# Altium project PCB_Project1.PrjPCB
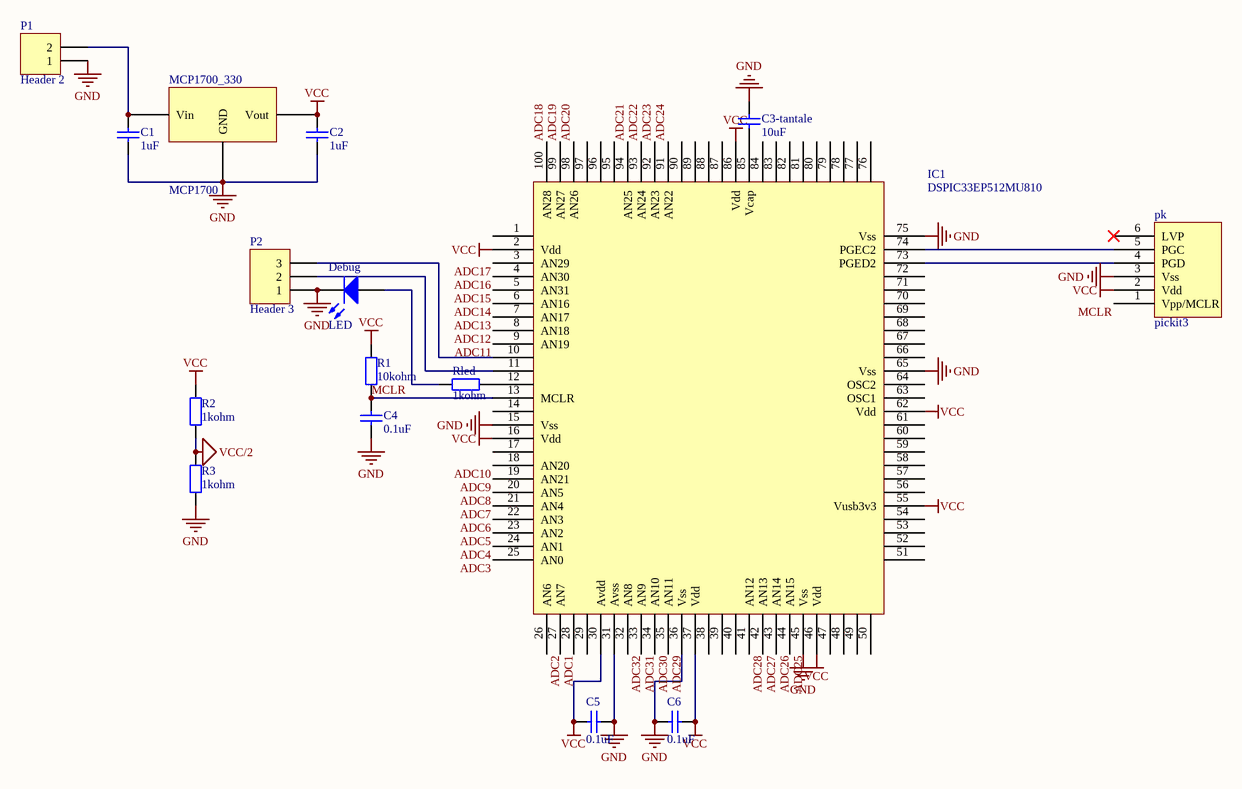
[diagram p0: Sheet1.SchDoc]
7 sheets, 224 parts. Net scope: global (net labels, ports and power ports of the same name join across sheets).
Board file: PCB1.PcbDoc
Sheets:
  Sheet1.SchDoc
  Sheet2.SchDoc
  Sheet3.SchDoc
  Sheet4.SchDoc
  Sheet5.SchDoc
  Sheet6.SchDoc
  Sheet7.SchDoc

## Sheet Sheet1.SchDoc
size A4

### Parts
C1  1uF  [cms805 - mini]
C2  1uF  [cms805 - mini]
C3-tantale  10uF  [cms805]
C4  0.1uF  [cms805 - mini]
C5  0.1uF  [cms805 - mini]
C6  0.1uF  [cms805 - mini]
Debug  LED  [cms1206]
IC1  DSPIC33EP512MU810  [TQFP100PF]
MCP1700_330  MCP1700  [SOT89]
P1  Header 2  [HDR1X2]
P2  Header 3  [HDR1X3]
pk  pickit3  [pickit3]
R1  10kohm  [cms805 - mini]
R2  1kohm  [cms805 - mini]
R3  1kohm  [cms805 - mini]
Rled  1kohm  [cms805 - mini]

### Nets
GND: C1.1 C2.1 C3-tantale.2 C4.1 C5.1 C6.2 Debug.2(K) IC1.15(Vss) IC1.31(Avss) IC1.36(Vss) IC1.45(Vss) IC1.65(Vss) IC1.75(Vss) MCP1700_330.1(GND) P1.1 P2.1 pk.3(Vss) R3.1
VCC: C2.2 C5.2 C6.1 IC1.2(Vdd) IC1.16(Vdd) IC1.30(Avdd) IC1.37(Vdd) IC1.46(Vdd) IC1.55(Vusb3v3) IC1.62(Vdd) IC1.86(Vdd) MCP1700_330.3(Vout) pk.2(Vdd) R1.2 R2.2
VCC/2: R2.1 R3.2
ADC1: IC1.27(AN7)
ADC2: IC1.26(AN6)
ADC3: IC1.25(AN0)
ADC4: IC1.24(AN1)
ADC5: IC1.23(AN2)
ADC6: IC1.22(AN3)
ADC7: IC1.21(AN4)
ADC8: IC1.20(AN5)
ADC9: IC1.19(AN21)
ADC10: IC1.18(AN20)
ADC11: IC1.9(AN19)
ADC12: IC1.8(AN18)
ADC13: IC1.7(AN17)
ADC14: IC1.6(AN16)
ADC15: IC1.5(AN31)
ADC16: IC1.4(AN30)
ADC17: IC1.3(AN29)
ADC18: IC1.100(AN28)
ADC19: IC1.99(AN27)
ADC20: IC1.98(AN26)
ADC21: IC1.94(AN25)
ADC22: IC1.93(AN24)
ADC23: IC1.92(AN23)
ADC24: IC1.91(AN22)
ADC25: IC1.44(AN15)
ADC26: IC1.43(AN14)
ADC27: IC1.42(AN13)
ADC28: IC1.41(AN12)
ADC29: IC1.35(AN11)
ADC30: IC1.34(AN10)
ADC31: IC1.33(AN9)
ADC32: IC1.32(AN8)
MCLR: C4.2 IC1.13(MCLR) pk.1(Vpp/MCLR) R1.1
NetC1_2: C1.2 MCP1700_330.2(Vin) P1.2
NetC3-tantale_1: C3-tantale.1 IC1.85(Vcap)
NetDebug_1: Debug.1(A) Rled.2
NetIC1_10: IC1.10 P2.3
NetIC1_11: IC1.11 P2.2
NetIC1_12: IC1.12 Rled.1
NetIC1_73: IC1.73(PGED2) pk.4(PGD)
NetIC1_74: IC1.74(PGEC2) pk.5(PGC)

Not connected (* = marked no-connect by the designer): IC1 1 14 17 28 29 38 39 40 47 48 49 50 51 52 53 54 56 57 58 59 60 61 63(OSC1) 64(OSC2) 66 67 68 69 70 71 72 76 77 78 79 80 81 82 83 84 87 88 89 90 95 96 97; pk 6(LVP)*

### Library data of the parts
C1 C2 C3-tantale C4-C6 = Capa
P1 = Header 2: Header, 2-Pin; LatestRevisionDate: 17-Jul-2002; LatestRevisionNote: Re-released for DXP Platform.; Publisher: Altium Limited
P2 = Header 3: Header, 3-Pin; LatestRevisionDate: 17-Jul-2002; LatestRevisionNote: Re-released for DXP Platform.; Publisher: Altium Limited
R1-R3 Rled = Resistance

## Sheet Sheet2.SchDoc
size A4
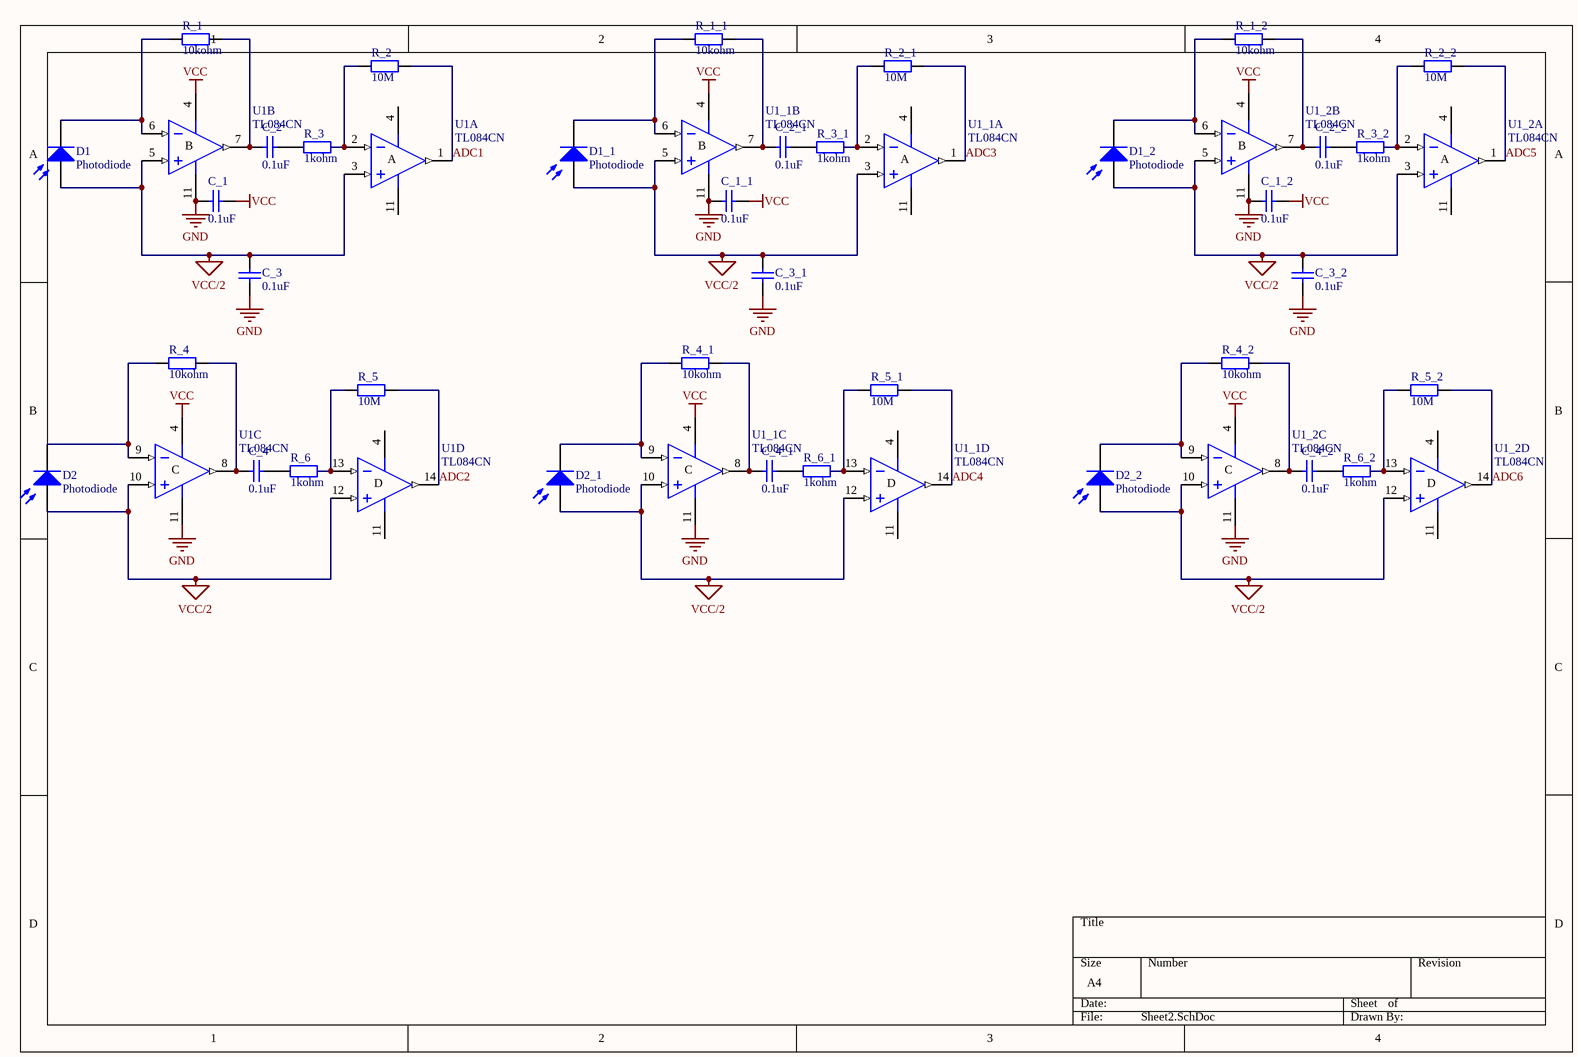
[diagram p1: Sheet2.SchDoc]

### Parts
C_1  0.1uF  [cms805 - mini]
C_1_1  0.1uF  [cms805 - mini]
C_1_2  0.1uF  [cms805 - mini]
C_2  0.1uF  [cms805 - mini]
C_2_1  0.1uF  [cms805 - mini]
C_2_2  0.1uF  [cms805 - mini]
C_3  0.1uF  [cms805 - mini]
C_3_1  0.1uF  [cms805 - mini]
C_3_2  0.1uF  [cms805 - mini]
C_4  0.1uF  [cms805 - mini]
C_4_1  0.1uF  [cms805 - mini]
C_4_2  0.1uF  [cms805 - mini]
D1  Photodiode  [TEMD1000]
D1_1  Photodiode  [TEMD1000]
D1_2  Photodiode  [TEMD1000]
D2  Photodiode  [TEMD1000]
D2_1  Photodiode  [TEMD1000]
D2_2  Photodiode  [TEMD1000]
R_1  10kohm  [cms805 - mini]
R_1_1  10kohm  [cms805 - mini]
R_1_2  10kohm  [cms805 - mini]
R_2  10M  [cms805 - mini]
R_2_1  10M  [cms805 - mini]
R_2_2  10M  [cms805 - mini]
R_3  1kohm  [cms805 - mini]
R_3_1  1kohm  [cms805 - mini]
R_3_2  1kohm  [cms805 - mini]
R_4  10kohm  [cms805 - mini]
R_4_1  10kohm  [cms805 - mini]
R_4_2  10kohm  [cms805 - mini]
R_5  10M  [cms805 - mini]
R_5_1  10M  [cms805 - mini]
R_5_2  10M  [cms805 - mini]
R_6  1kohm  [cms805 - mini]
R_6_1  1kohm  [cms805 - mini]
R_6_2  1kohm  [cms805 - mini]
U1  TL084CN  [TSSOP14]  (parts A,B,C,D of 4)
U1_1  TL084CN  [TSSOP14]  (parts A,B,C,D of 4)
U1_2  TL084CN  [TSSOP14]  (parts A,B,C,D of 4)

### Nets
GND: C_1.1 C_1_1.1 C_1_2.1 C_3.1 C_3_1.1 C_3_2.1 U1.11(V-) U1_1.11(V-) U1_2.11(V-)
VCC: C_1.2 C_1_1.2 C_1_2.2 U1.4(V+) U1_1.4(V+) U1_2.4(V+)
VCC/2: C_3.2 C_3_1.2 C_3_2.2 D1.1(A) D1_1.1(A) D1_2.1(A) D2.1(A) D2_1.1(A) D2_2.1(A) U1.3(IN+) U1.5(IN+) U1.10(IN+) U1.12(IN+) U1_1.3(IN+) U1_1.5(IN+) U1_1.10(IN+) U1_1.12(IN+) U1_2.3(IN+) U1_2.5(IN+) U1_2.10(IN+) U1_2.12(IN+)
ADC1: R_2.2 U1.1(OUT)
ADC2: R_5.2 U1.14(OUT)
ADC3: R_2_1.2 U1_1.1(OUT)
ADC4: R_5_1.2 U1_1.14(OUT)
ADC5: R_2_2.2 U1_2.1(OUT)
ADC6: R_5_2.2 U1_2.14(OUT)
NetC_2_1: C_2.1 R_3.1
NetC_2_1_1: C_2_1.1 R_3_1.1
NetC_2_1_2: C_2_1.2 R_1_1.2 U1_1.7(OUT)
NetC_2_2: C_2.2 R_1.2 U1.7(OUT)
NetC_2_2_1: C_2_2.1 R_3_2.1
NetC_2_2_2: C_2_2.2 R_1_2.2 U1_2.7(OUT)
NetC_4_1: C_4.1 R_6.1
NetC_4_1_1: C_4_1.1 R_6_1.1
NetC_4_1_2: C_4_1.2 R_4_1.2 U1_1.8(OUT)
NetC_4_2: C_4.2 R_4.2 U1.8(OUT)
NetC_4_2_1: C_4_2.1 R_6_2.1
NetC_4_2_2: C_4_2.2 R_4_2.2 U1_2.8(OUT)
NetD1_1_2: D1_1.2(K) R_1_1.1 U1_1.6(IN-)
NetD1_2: D1.2(K) R_1.1 U1.6(IN-)
NetD1_2_2: D1_2.2(K) R_1_2.1 U1_2.6(IN-)
NetD2_1_2: D2_1.2(K) R_4_1.1 U1_1.9(IN-)
NetD2_2: D2.2(K) R_4.1 U1.9(IN-)
NetD2_2_2: D2_2.2(K) R_4_2.1 U1_2.9(IN-)
NetR_2_1: R_2.1 R_3.2 U1.2(IN-)
NetR_2_1_1: R_2_1.1 R_3_1.2 U1_1.2(IN-)
NetR_2_2_1: R_2_2.1 R_3_2.2 U1_2.2(IN-)
NetR_5_1: R_5.1 R_6.2 U1.13(IN-)
NetR_5_1_1: R_5_1.1 R_6_1.2 U1_1.13(IN-)
NetR_5_2_1: R_5_2.1 R_6_2.2 U1_2.13(IN-)

### Notes on the sheet
- (in symbol TL084CN, part A) A
- (in symbol TL084CN, part B) B
- (in symbol TL084CN, part C) C
- (in symbol TL084CN, part D) D

### Library data of the parts
C_1 C_1_1 C_1_2 C_2 C_2_1 C_2_2 C_3 C_3_1 C_3_2 C_4 C_4_1 C_4_2 = Capa
R_1 R_1_1 R_1_2 R_2 R_2_1 R_2_2 R_3 R_3_1 R_3_2 R_4 R_4_1 R_4_2 R_5 R_5_1 R_5_2 R_6 R_6_1 R_6_2 = Resistance
U1 U1_1 U1_2 = TL084CN: General-Purpose J-FET Quad Operational Amplifier; Published: 24-Aug-2001; LatestRevisionDate: 06-Jun-2005; LatestRevisionNote: Stylized 3D Model Added.; DatasheetVersion: Jan-1999; PackageVersion: Jan-1997; PackageReference: DIP14; Publisher: Altium Limited; PackageDescription: DIP; 14 Leads; Row Spacing 7.62 mm; Pitch 2.54 mm; ComponentLink1Description: Manufacturer Link; ComponentLink1URL: http://www.st.com/; ComponentLink2Description: Datasheet; ComponentLink2URL: http://www.st.com/stonline/products/literature/ds/2301/tl084.pdf
D1 D1_1 D1_2 D2 D2_1 D2_2 = Photodiode: Published: 24-Mar-1999; LatestRevisionDate: 17-Jul-2002; LatestRevisionNote: Re-released for DXP Platform.; PackageReference: PIN2; Publisher: Altium Limited

## Sheet Sheet3.SchDoc
size A4
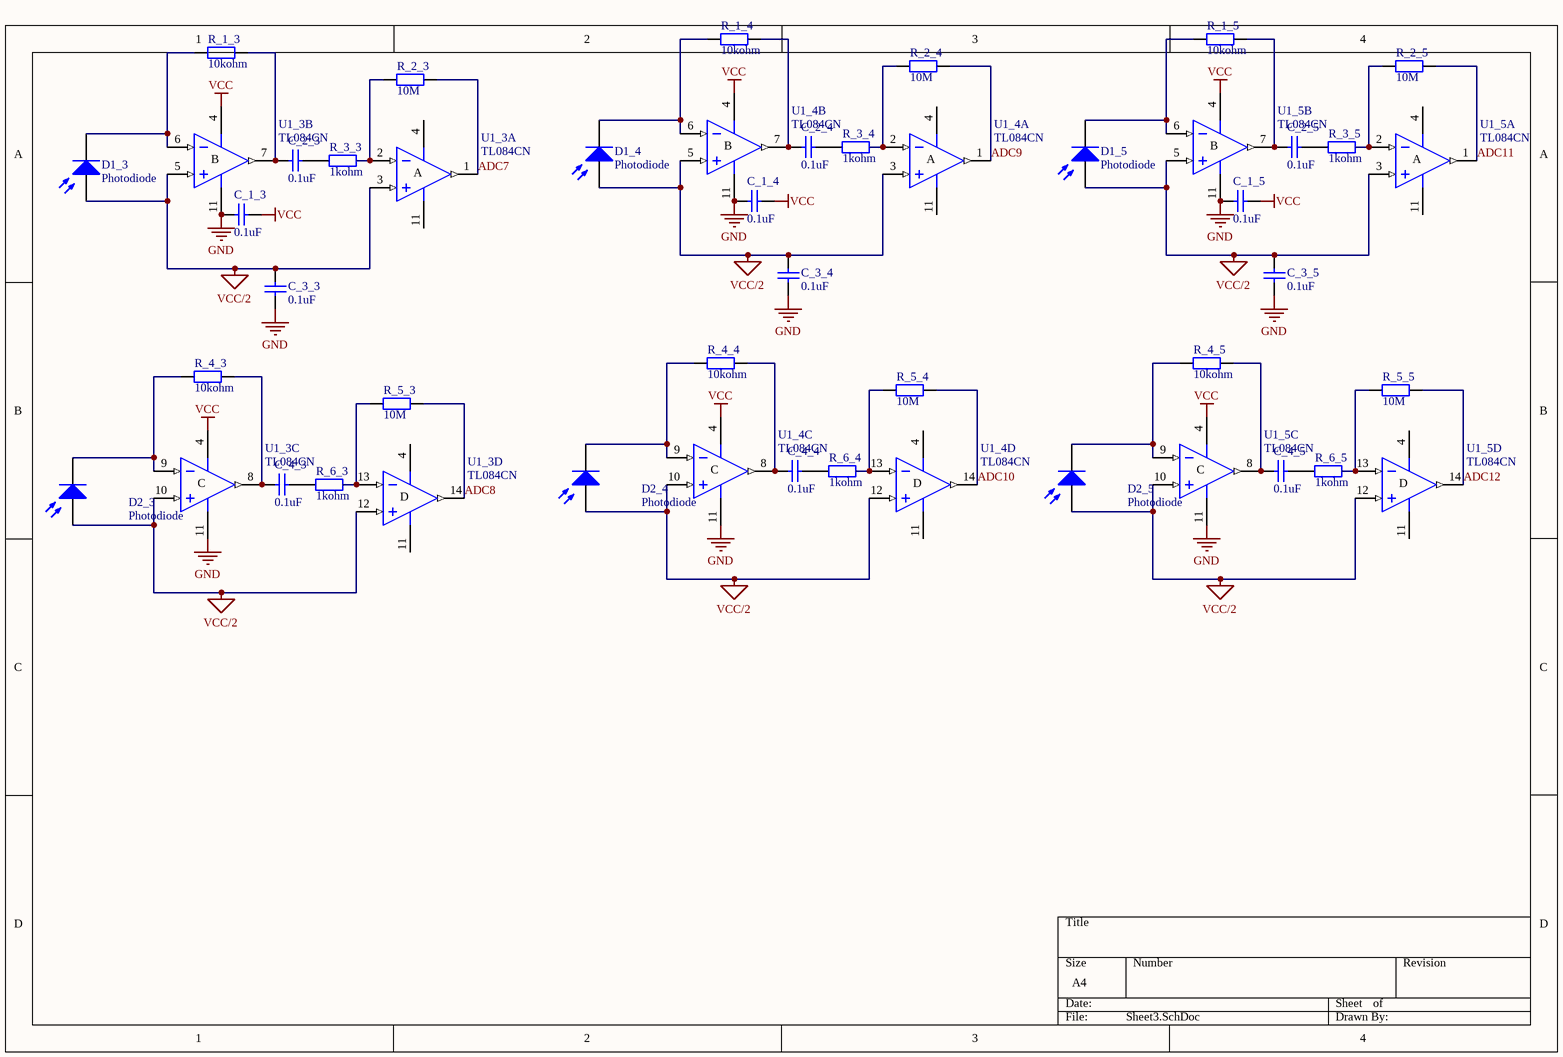
[diagram p2: Sheet3.SchDoc]

### Parts
C_1_3  0.1uF  [cms805 - mini]
C_1_4  0.1uF  [cms805 - mini]
C_1_5  0.1uF  [cms805 - mini]
C_2_3  0.1uF  [cms805 - mini]
C_2_4  0.1uF  [cms805 - mini]
C_2_5  0.1uF  [cms805 - mini]
C_3_3  0.1uF  [cms805 - mini]
C_3_4  0.1uF  [cms805 - mini]
C_3_5  0.1uF  [cms805 - mini]
C_4_3  0.1uF  [cms805 - mini]
C_4_4  0.1uF  [cms805 - mini]
C_4_5  0.1uF  [cms805 - mini]
D1_3  Photodiode  [TEMD1000]
D1_4  Photodiode  [TEMD1000]
D1_5  Photodiode  [TEMD1000]
D2_3  Photodiode  [TEMD1000]
D2_4  Photodiode  [TEMD1000]
D2_5  Photodiode  [TEMD1000]
R_1_3  10kohm  [cms805 - mini]
R_1_4  10kohm  [cms805 - mini]
R_1_5  10kohm  [cms805 - mini]
R_2_3  10M  [cms805 - mini]
R_2_4  10M  [cms805 - mini]
R_2_5  10M  [cms805 - mini]
R_3_3  1kohm  [cms805 - mini]
R_3_4  1kohm  [cms805 - mini]
R_3_5  1kohm  [cms805 - mini]
R_4_3  10kohm  [cms805 - mini]
R_4_4  10kohm  [cms805 - mini]
R_4_5  10kohm  [cms805 - mini]
R_5_3  10M  [cms805 - mini]
R_5_4  10M  [cms805 - mini]
R_5_5  10M  [cms805 - mini]
R_6_3  1kohm  [cms805 - mini]
R_6_4  1kohm  [cms805 - mini]
R_6_5  1kohm  [cms805 - mini]
U1_3  TL084CN  [TSSOP14]  (parts A,B,C,D of 4)
U1_4  TL084CN  [TSSOP14]  (parts A,B,C,D of 4)
U1_5  TL084CN  [TSSOP14]  (parts A,B,C,D of 4)

### Nets
GND: C_1_3.1 C_1_4.1 C_1_5.1 C_3_3.1 C_3_4.1 C_3_5.1 U1_3.11(V-) U1_4.11(V-) U1_5.11(V-)
VCC: C_1_3.2 C_1_4.2 C_1_5.2 U1_3.4(V+) U1_4.4(V+) U1_5.4(V+)
VCC/2: C_3_3.2 C_3_4.2 C_3_5.2 D1_3.1(A) D1_4.1(A) D1_5.1(A) D2_3.1(A) D2_4.1(A) D2_5.1(A) U1_3.3(IN+) U1_3.5(IN+) U1_3.10(IN+) U1_3.12(IN+) U1_4.3(IN+) U1_4.5(IN+) U1_4.10(IN+) U1_4.12(IN+) U1_5.3(IN+) U1_5.5(IN+) U1_5.10(IN+) U1_5.12(IN+)
ADC7: R_2_3.2 U1_3.1(OUT)
ADC8: R_5_3.2 U1_3.14(OUT)
ADC9: R_2_4.2 U1_4.1(OUT)
ADC10: R_5_4.2 U1_4.14(OUT)
ADC11: R_2_5.2 U1_5.1(OUT)
ADC12: R_5_5.2 U1_5.14(OUT)
NetC_2_3_1: C_2_3.1 R_3_3.1
NetC_2_3_2: C_2_3.2 R_1_3.2 U1_3.7(OUT)
NetC_2_4_1: C_2_4.1 R_3_4.1
NetC_2_4_2: C_2_4.2 R_1_4.2 U1_4.7(OUT)
NetC_2_5_1: C_2_5.1 R_3_5.1
NetC_2_5_2: C_2_5.2 R_1_5.2 U1_5.7(OUT)
NetC_4_3_1: C_4_3.1 R_6_3.1
NetC_4_3_2: C_4_3.2 R_4_3.2 U1_3.8(OUT)
NetC_4_4_1: C_4_4.1 R_6_4.1
NetC_4_4_2: C_4_4.2 R_4_4.2 U1_4.8(OUT)
NetC_4_5_1: C_4_5.1 R_6_5.1
NetC_4_5_2: C_4_5.2 R_4_5.2 U1_5.8(OUT)
NetD1_3_2: D1_3.2(K) R_1_3.1 U1_3.6(IN-)
NetD1_4_2: D1_4.2(K) R_1_4.1 U1_4.6(IN-)
NetD1_5_2: D1_5.2(K) R_1_5.1 U1_5.6(IN-)
NetD2_3_2: D2_3.2(K) R_4_3.1 U1_3.9(IN-)
NetD2_4_2: D2_4.2(K) R_4_4.1 U1_4.9(IN-)
NetD2_5_2: D2_5.2(K) R_4_5.1 U1_5.9(IN-)
NetR_2_3_1: R_2_3.1 R_3_3.2 U1_3.2(IN-)
NetR_2_4_1: R_2_4.1 R_3_4.2 U1_4.2(IN-)
NetR_2_5_1: R_2_5.1 R_3_5.2 U1_5.2(IN-)
NetR_5_3_1: R_5_3.1 R_6_3.2 U1_3.13(IN-)
NetR_5_4_1: R_5_4.1 R_6_4.2 U1_4.13(IN-)
NetR_5_5_1: R_5_5.1 R_6_5.2 U1_5.13(IN-)

### Notes on the sheet
- (in symbol TL084CN, part A) A
- (in symbol TL084CN, part B) B
- (in symbol TL084CN, part C) C
- (in symbol TL084CN, part D) D

### Library data of the parts
C_1_3-C_1_5 C_2_3-C_2_5 C_3_3-C_3_5 C_4_3-C_4_5 = Capa
R_1_3-R_1_5 R_2_3-R_2_5 R_3_3-R_3_5 R_4_3-R_4_5 R_5_3-R_5_5 R_6_3-R_6_5 = Resistance
U1_3-U1_5 = TL084CN: as U1 on sheet Sheet2; Published: 24-Aug-2001; LatestRevisionDate: 06-Jun-2005; LatestRevisionNote: Stylized 3D Model Added.; DatasheetVersion: Jan-1999; PackageVersion: Jan-1997; PackageReference: DIP14; Publisher: Altium Limited; PackageDescription: DIP; 14 Leads; Row Spacing 7.62 mm; Pitch 2.54 mm; ComponentLink1Description: Manufacturer Link; ComponentLink1URL: http://www.st.com/; ComponentLink2Description: Datasheet; ComponentLink2URL: http://www.st.com/stonline/products/literature/ds/2301/tl084.pdf
D1_3-D1_5 D2_3-D2_5 = Photodiode: Published: 24-Mar-1999; LatestRevisionDate: 17-Jul-2002; LatestRevisionNote: Re-released for DXP Platform.; PackageReference: PIN2; Publisher: Altium Limited

## Sheet Sheet4.SchDoc
size A4
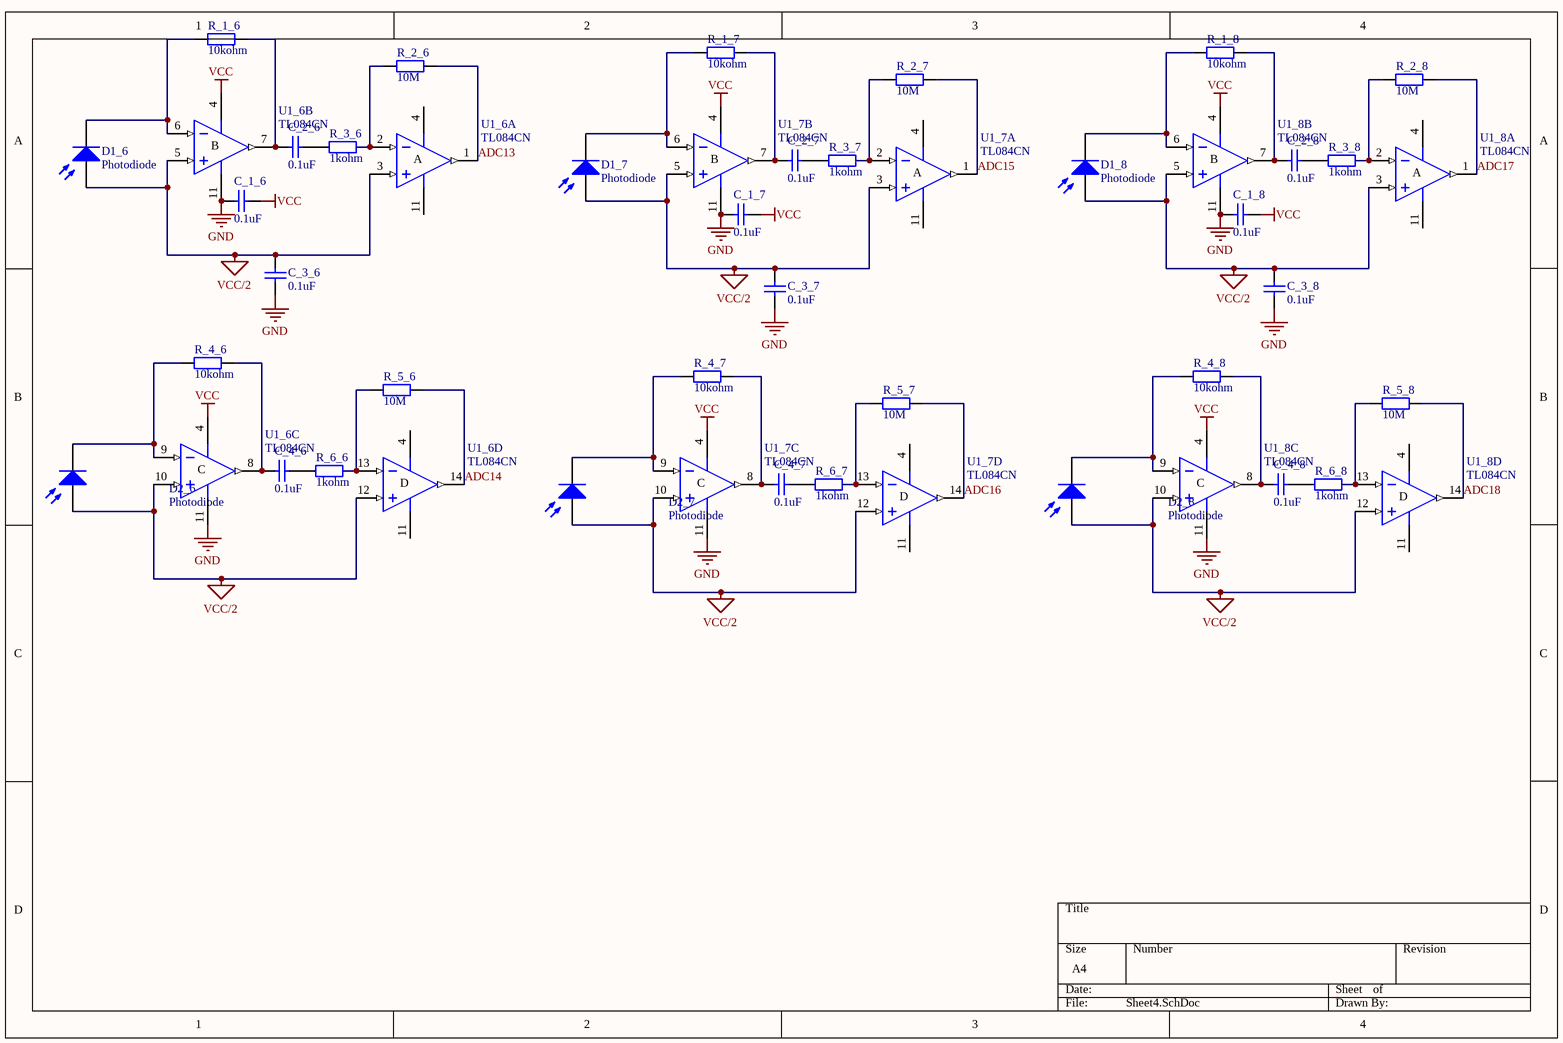
[diagram p3: Sheet4.SchDoc]

### Parts
C_1_6  0.1uF  [cms805 - mini]
C_1_7  0.1uF  [cms805 - mini]
C_1_8  0.1uF  [cms805 - mini]
C_2_6  0.1uF  [cms805 - mini]
C_2_7  0.1uF  [cms805 - mini]
C_2_8  0.1uF  [cms805 - mini]
C_3_6  0.1uF  [cms805 - mini]
C_3_7  0.1uF  [cms805 - mini]
C_3_8  0.1uF  [cms805 - mini]
C_4_6  0.1uF  [cms805 - mini]
C_4_7  0.1uF  [cms805 - mini]
C_4_8  0.1uF  [cms805 - mini]
D1_6  Photodiode  [TEMD1000]
D1_7  Photodiode  [TEMD1000]
D1_8  Photodiode  [TEMD1000]
D2_6  Photodiode  [TEMD1000]
D2_7  Photodiode  [TEMD1000]
D2_8  Photodiode  [TEMD1000]
R_1_6  10kohm  [cms805 - mini]
R_1_7  10kohm  [cms805 - mini]
R_1_8  10kohm  [cms805 - mini]
R_2_6  10M  [cms805 - mini]
R_2_7  10M  [cms805 - mini]
R_2_8  10M  [cms805 - mini]
R_3_6  1kohm  [cms805 - mini]
R_3_7  1kohm  [cms805 - mini]
R_3_8  1kohm  [cms805 - mini]
R_4_6  10kohm  [cms805 - mini]
R_4_7  10kohm  [cms805 - mini]
R_4_8  10kohm  [cms805 - mini]
R_5_6  10M  [cms805 - mini]
R_5_7  10M  [cms805 - mini]
R_5_8  10M  [cms805 - mini]
R_6_6  1kohm  [cms805 - mini]
R_6_7  1kohm  [cms805 - mini]
R_6_8  1kohm  [cms805 - mini]
U1_6  TL084CN  [TSSOP14]  (parts A,B,C,D of 4)
U1_7  TL084CN  [TSSOP14]  (parts A,B,C,D of 4)
U1_8  TL084CN  [TSSOP14]  (parts A,B,C,D of 4)

### Nets
GND: C_1_6.1 C_1_7.1 C_1_8.1 C_3_6.1 C_3_7.1 C_3_8.1 U1_6.11(V-) U1_7.11(V-) U1_8.11(V-)
VCC: C_1_6.2 C_1_7.2 C_1_8.2 U1_6.4(V+) U1_7.4(V+) U1_8.4(V+)
VCC/2: C_3_6.2 C_3_7.2 C_3_8.2 D1_6.1(A) D1_7.1(A) D1_8.1(A) D2_6.1(A) D2_7.1(A) D2_8.1(A) U1_6.3(IN+) U1_6.5(IN+) U1_6.10(IN+) U1_6.12(IN+) U1_7.3(IN+) U1_7.5(IN+) U1_7.10(IN+) U1_7.12(IN+) U1_8.3(IN+) U1_8.5(IN+) U1_8.10(IN+) U1_8.12(IN+)
ADC13: R_2_6.2 U1_6.1(OUT)
ADC14: R_5_6.2 U1_6.14(OUT)
ADC15: R_2_7.2 U1_7.1(OUT)
ADC16: R_5_7.2 U1_7.14(OUT)
ADC17: R_2_8.2 U1_8.1(OUT)
ADC18: R_5_8.2 U1_8.14(OUT)
NetC_2_6_1: C_2_6.1 R_3_6.1
NetC_2_6_2: C_2_6.2 R_1_6.2 U1_6.7(OUT)
NetC_2_7_1: C_2_7.1 R_3_7.1
NetC_2_7_2: C_2_7.2 R_1_7.2 U1_7.7(OUT)
NetC_2_8_1: C_2_8.1 R_3_8.1
NetC_2_8_2: C_2_8.2 R_1_8.2 U1_8.7(OUT)
NetC_4_6_1: C_4_6.1 R_6_6.1
NetC_4_6_2: C_4_6.2 R_4_6.2 U1_6.8(OUT)
NetC_4_7_1: C_4_7.1 R_6_7.1
NetC_4_7_2: C_4_7.2 R_4_7.2 U1_7.8(OUT)
NetC_4_8_1: C_4_8.1 R_6_8.1
NetC_4_8_2: C_4_8.2 R_4_8.2 U1_8.8(OUT)
NetD1_6_2: D1_6.2(K) R_1_6.1 U1_6.6(IN-)
NetD1_7_2: D1_7.2(K) R_1_7.1 U1_7.6(IN-)
NetD1_8_2: D1_8.2(K) R_1_8.1 U1_8.6(IN-)
NetD2_6_2: D2_6.2(K) R_4_6.1 U1_6.9(IN-)
NetD2_7_2: D2_7.2(K) R_4_7.1 U1_7.9(IN-)
NetD2_8_2: D2_8.2(K) R_4_8.1 U1_8.9(IN-)
NetR_2_6_1: R_2_6.1 R_3_6.2 U1_6.2(IN-)
NetR_2_7_1: R_2_7.1 R_3_7.2 U1_7.2(IN-)
NetR_2_8_1: R_2_8.1 R_3_8.2 U1_8.2(IN-)
NetR_5_6_1: R_5_6.1 R_6_6.2 U1_6.13(IN-)
NetR_5_7_1: R_5_7.1 R_6_7.2 U1_7.13(IN-)
NetR_5_8_1: R_5_8.1 R_6_8.2 U1_8.13(IN-)

### Notes on the sheet
- (in symbol TL084CN, part A) A
- (in symbol TL084CN, part B) B
- (in symbol TL084CN, part C) C
- (in symbol TL084CN, part D) D

### Library data of the parts
C_1_6-C_1_8 C_2_6-C_2_8 C_3_6-C_3_8 C_4_6-C_4_8 = Capa
R_1_6-R_1_8 R_2_6-R_2_8 R_3_6-R_3_8 R_4_6-R_4_8 R_5_6-R_5_8 R_6_6-R_6_8 = Resistance
U1_6-U1_8 = TL084CN: as U1 on sheet Sheet2; Published: 24-Aug-2001; LatestRevisionDate: 06-Jun-2005; LatestRevisionNote: Stylized 3D Model Added.; DatasheetVersion: Jan-1999; PackageVersion: Jan-1997; PackageReference: DIP14; Publisher: Altium Limited; PackageDescription: DIP; 14 Leads; Row Spacing 7.62 mm; Pitch 2.54 mm; ComponentLink1Description: Manufacturer Link; ComponentLink1URL: http://www.st.com/; ComponentLink2Description: Datasheet; ComponentLink2URL: http://www.st.com/stonline/products/literature/ds/2301/tl084.pdf
D1_6-D1_8 D2_6-D2_8 = Photodiode: Published: 24-Mar-1999; LatestRevisionDate: 17-Jul-2002; LatestRevisionNote: Re-released for DXP Platform.; PackageReference: PIN2; Publisher: Altium Limited

## Sheet Sheet5.SchDoc
size A4
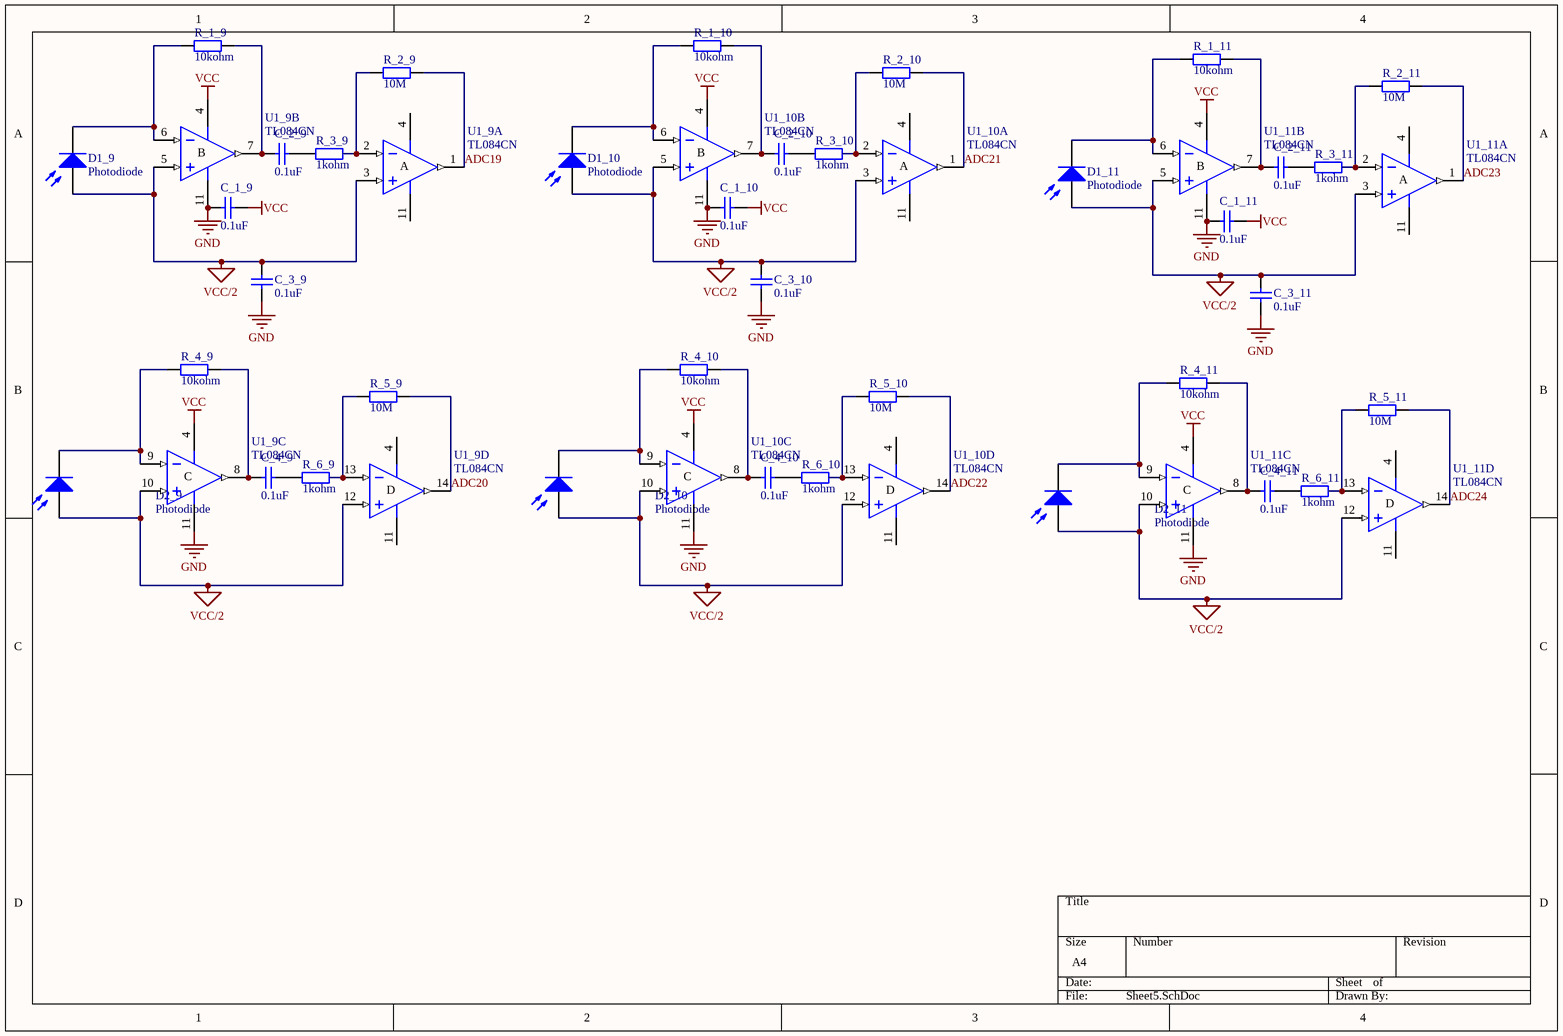
[diagram p4: Sheet5.SchDoc]

### Parts
C_1_9  0.1uF  [cms805 - mini]
C_1_10  0.1uF  [cms805 - mini]
C_1_11  0.1uF  [cms805 - mini]
C_2_9  0.1uF  [cms805 - mini]
C_2_10  0.1uF  [cms805 - mini]
C_2_11  0.1uF  [cms805 - mini]
C_3_9  0.1uF  [cms805 - mini]
C_3_10  0.1uF  [cms805 - mini]
C_3_11  0.1uF  [cms805 - mini]
C_4_9  0.1uF  [cms805 - mini]
C_4_10  0.1uF  [cms805 - mini]
C_4_11  0.1uF  [cms805 - mini]
D1_9  Photodiode  [TEMD1000]
D1_10  Photodiode  [TEMD1000]
D1_11  Photodiode  [TEMD1000]
D2_9  Photodiode  [TEMD1000]
D2_10  Photodiode  [TEMD1000]
D2_11  Photodiode  [TEMD1000]
R_1_9  10kohm  [cms805 - mini]
R_1_10  10kohm  [cms805 - mini]
R_1_11  10kohm  [cms805 - mini]
R_2_9  10M  [cms805 - mini]
R_2_10  10M  [cms805 - mini]
R_2_11  10M  [cms805 - mini]
R_3_9  1kohm  [cms805 - mini]
R_3_10  1kohm  [cms805 - mini]
R_3_11  1kohm  [cms805 - mini]
R_4_9  10kohm  [cms805 - mini]
R_4_10  10kohm  [cms805 - mini]
R_4_11  10kohm  [cms805 - mini]
R_5_9  10M  [cms805 - mini]
R_5_10  10M  [cms805 - mini]
R_5_11  10M  [cms805 - mini]
R_6_9  1kohm  [cms805 - mini]
R_6_10  1kohm  [cms805 - mini]
R_6_11  1kohm  [cms805 - mini]
U1_9  TL084CN  [TSSOP14]  (parts A,B,C,D of 4)
U1_10  TL084CN  [TSSOP14]  (parts A,B,C,D of 4)
U1_11  TL084CN  [TSSOP14]  (parts A,B,C,D of 4)

### Nets
GND: C_1_9.1 C_1_10.1 C_1_11.1 C_3_9.1 C_3_10.1 C_3_11.1 U1_9.11(V-) U1_10.11(V-) U1_11.11(V-)
VCC: C_1_9.2 C_1_10.2 C_1_11.2 U1_9.4(V+) U1_10.4(V+) U1_11.4(V+)
VCC/2: C_3_9.2 C_3_10.2 C_3_11.2 D1_9.1(A) D1_10.1(A) D1_11.1(A) D2_9.1(A) D2_10.1(A) D2_11.1(A) U1_9.3(IN+) U1_9.5(IN+) U1_9.10(IN+) U1_9.12(IN+) U1_10.3(IN+) U1_10.5(IN+) U1_10.10(IN+) U1_10.12(IN+) U1_11.3(IN+) U1_11.5(IN+) U1_11.10(IN+) U1_11.12(IN+)
ADC19: R_2_9.2 U1_9.1(OUT)
ADC20: R_5_9.2 U1_9.14(OUT)
ADC21: R_2_10.2 U1_10.1(OUT)
ADC22: R_5_10.2 U1_10.14(OUT)
ADC23: R_2_11.2 U1_11.1(OUT)
ADC24: R_5_11.2 U1_11.14(OUT)
NetC_2_9_1: C_2_9.1 R_3_9.1
NetC_2_9_2: C_2_9.2 R_1_9.2 U1_9.7(OUT)
NetC_2_10_1: C_2_10.1 R_3_10.1
NetC_2_10_2: C_2_10.2 R_1_10.2 U1_10.7(OUT)
NetC_2_11_1: C_2_11.1 R_3_11.1
NetC_2_11_2: C_2_11.2 R_1_11.2 U1_11.7(OUT)
NetC_4_9_1: C_4_9.1 R_6_9.1
NetC_4_9_2: C_4_9.2 R_4_9.2 U1_9.8(OUT)
NetC_4_10_1: C_4_10.1 R_6_10.1
NetC_4_10_2: C_4_10.2 R_4_10.2 U1_10.8(OUT)
NetC_4_11_1: C_4_11.1 R_6_11.1
NetC_4_11_2: C_4_11.2 R_4_11.2 U1_11.8(OUT)
NetD1_9_2: D1_9.2(K) R_1_9.1 U1_9.6(IN-)
NetD1_10_2: D1_10.2(K) R_1_10.1 U1_10.6(IN-)
NetD1_11_2: D1_11.2(K) R_1_11.1 U1_11.6(IN-)
NetD2_9_2: D2_9.2(K) R_4_9.1 U1_9.9(IN-)
NetD2_10_2: D2_10.2(K) R_4_10.1 U1_10.9(IN-)
NetD2_11_2: D2_11.2(K) R_4_11.1 U1_11.9(IN-)
NetR_2_9_1: R_2_9.1 R_3_9.2 U1_9.2(IN-)
NetR_2_10_1: R_2_10.1 R_3_10.2 U1_10.2(IN-)
NetR_2_11_1: R_2_11.1 R_3_11.2 U1_11.2(IN-)
NetR_5_9_1: R_5_9.1 R_6_9.2 U1_9.13(IN-)
NetR_5_10_1: R_5_10.1 R_6_10.2 U1_10.13(IN-)
NetR_5_11_1: R_5_11.1 R_6_11.2 U1_11.13(IN-)

### Notes on the sheet
- (in symbol TL084CN, part A) A
- (in symbol TL084CN, part B) B
- (in symbol TL084CN, part C) C
- (in symbol TL084CN, part D) D

### Library data of the parts
C_1_9-C_1_11 C_2_9-C_2_11 C_3_9-C_3_11 C_4_9-C_4_11 = Capa
R_1_9-R_1_11 R_2_9-R_2_11 R_3_9-R_3_11 R_4_9-R_4_11 R_5_9-R_5_11 R_6_9-R_6_11 = Resistance
U1_9-U1_11 = TL084CN: as U1 on sheet Sheet2; Published: 24-Aug-2001; LatestRevisionDate: 06-Jun-2005; LatestRevisionNote: Stylized 3D Model Added.; DatasheetVersion: Jan-1999; PackageVersion: Jan-1997; PackageReference: DIP14; Publisher: Altium Limited; PackageDescription: DIP; 14 Leads; Row Spacing 7.62 mm; Pitch 2.54 mm; ComponentLink1Description: Manufacturer Link; ComponentLink1URL: http://www.st.com/; ComponentLink2Description: Datasheet; ComponentLink2URL: http://www.st.com/stonline/products/literature/ds/2301/tl084.pdf
D1_9-D1_11 D2_9-D2_11 = Photodiode: Published: 24-Mar-1999; LatestRevisionDate: 17-Jul-2002; LatestRevisionNote: Re-released for DXP Platform.; PackageReference: PIN2; Publisher: Altium Limited

## Sheet Sheet6.SchDoc
size A4
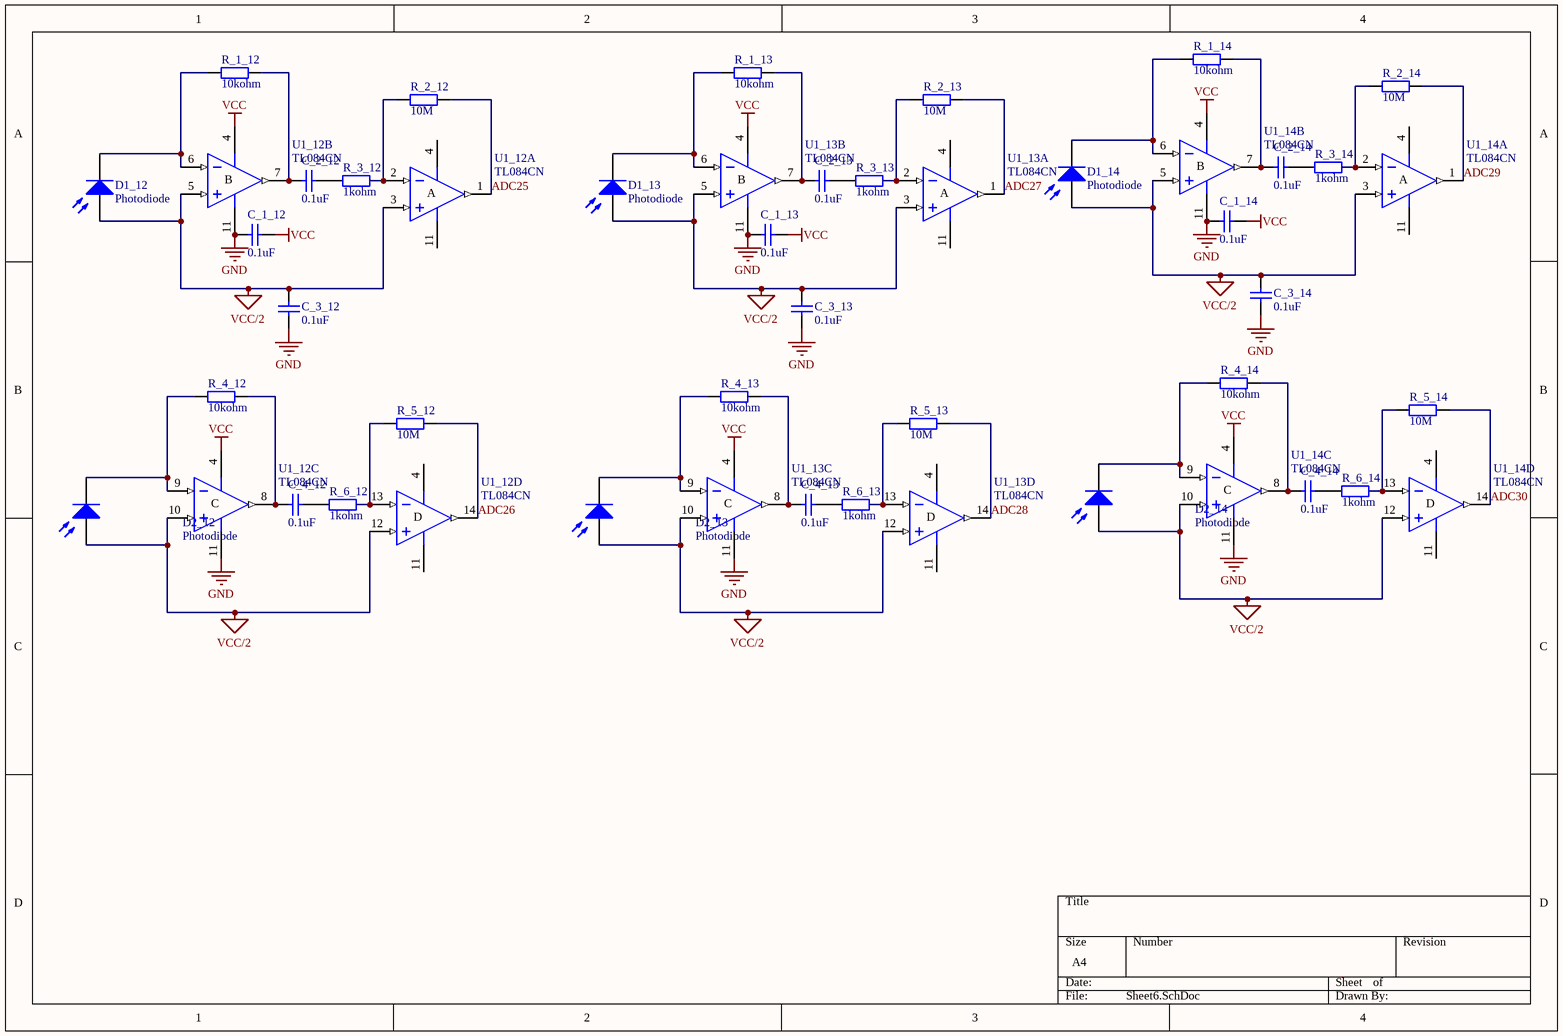
[diagram p5: Sheet6.SchDoc]

### Parts
C_1_12  0.1uF  [cms805 - mini]
C_1_13  0.1uF  [cms805 - mini]
C_1_14  0.1uF  [cms805 - mini]
C_2_12  0.1uF  [cms805 - mini]
C_2_13  0.1uF  [cms805 - mini]
C_2_14  0.1uF  [cms805 - mini]
C_3_12  0.1uF  [cms805 - mini]
C_3_13  0.1uF  [cms805 - mini]
C_3_14  0.1uF  [cms805 - mini]
C_4_12  0.1uF  [cms805 - mini]
C_4_13  0.1uF  [cms805 - mini]
C_4_14  0.1uF  [cms805 - mini]
D1_12  Photodiode  [TEMD1000]
D1_13  Photodiode  [TEMD1000]
D1_14  Photodiode  [TEMD1000]
D2_12  Photodiode  [TEMD1000]
D2_13  Photodiode  [TEMD1000]
D2_14  Photodiode  [TEMD1000]
R_1_12  10kohm  [cms805 - mini]
R_1_13  10kohm  [cms805 - mini]
R_1_14  10kohm  [cms805 - mini]
R_2_12  10M  [cms805 - mini]
R_2_13  10M  [cms805 - mini]
R_2_14  10M  [cms805 - mini]
R_3_12  1kohm  [cms805 - mini]
R_3_13  1kohm  [cms805 - mini]
R_3_14  1kohm  [cms805 - mini]
R_4_12  10kohm  [cms805 - mini]
R_4_13  10kohm  [cms805 - mini]
R_4_14  10kohm  [cms805 - mini]
R_5_12  10M  [cms805 - mini]
R_5_13  10M  [cms805 - mini]
R_5_14  10M  [cms805 - mini]
R_6_12  1kohm  [cms805 - mini]
R_6_13  1kohm  [cms805 - mini]
R_6_14  1kohm  [cms805 - mini]
U1_12  TL084CN  [TSSOP14]  (parts A,B,C,D of 4)
U1_13  TL084CN  [TSSOP14]  (parts A,B,C,D of 4)
U1_14  TL084CN  [TSSOP14]  (parts A,B,C,D of 4)

### Nets
GND: C_1_12.1 C_1_13.1 C_1_14.1 C_3_12.1 C_3_13.1 C_3_14.1 U1_12.11(V-) U1_13.11(V-) U1_14.11(V-)
VCC: C_1_12.2 C_1_13.2 C_1_14.2 U1_12.4(V+) U1_13.4(V+) U1_14.4(V+)
VCC/2: C_3_12.2 C_3_13.2 C_3_14.2 D1_12.1(A) D1_13.1(A) D1_14.1(A) D2_12.1(A) D2_13.1(A) D2_14.1(A) U1_12.3(IN+) U1_12.5(IN+) U1_12.10(IN+) U1_12.12(IN+) U1_13.3(IN+) U1_13.5(IN+) U1_13.10(IN+) U1_13.12(IN+) U1_14.3(IN+) U1_14.5(IN+) U1_14.10(IN+) U1_14.12(IN+)
ADC25: R_2_12.2 U1_12.1(OUT)
ADC26: R_5_12.2 U1_12.14(OUT)
ADC27: R_2_13.2 U1_13.1(OUT)
ADC28: R_5_13.2 U1_13.14(OUT)
ADC29: R_2_14.2 U1_14.1(OUT)
ADC30: R_5_14.2 U1_14.14(OUT)
NetC_2_12_1: C_2_12.1 R_3_12.1
NetC_2_12_2: C_2_12.2 R_1_12.2 U1_12.7(OUT)
NetC_2_13_1: C_2_13.1 R_3_13.1
NetC_2_13_2: C_2_13.2 R_1_13.2 U1_13.7(OUT)
NetC_2_14_1: C_2_14.1 R_3_14.1
NetC_2_14_2: C_2_14.2 R_1_14.2 U1_14.7(OUT)
NetC_4_12_1: C_4_12.1 R_6_12.1
NetC_4_12_2: C_4_12.2 R_4_12.2 U1_12.8(OUT)
NetC_4_13_1: C_4_13.1 R_6_13.1
NetC_4_13_2: C_4_13.2 R_4_13.2 U1_13.8(OUT)
NetC_4_14_1: C_4_14.1 R_6_14.1
NetC_4_14_2: C_4_14.2 R_4_14.2 U1_14.8(OUT)
NetD1_12_2: D1_12.2(K) R_1_12.1 U1_12.6(IN-)
NetD1_13_2: D1_13.2(K) R_1_13.1 U1_13.6(IN-)
NetD1_14_2: D1_14.2(K) R_1_14.1 U1_14.6(IN-)
NetD2_12_2: D2_12.2(K) R_4_12.1 U1_12.9(IN-)
NetD2_13_2: D2_13.2(K) R_4_13.1 U1_13.9(IN-)
NetD2_14_2: D2_14.2(K) R_4_14.1 U1_14.9(IN-)
NetR_2_12_1: R_2_12.1 R_3_12.2 U1_12.2(IN-)
NetR_2_13_1: R_2_13.1 R_3_13.2 U1_13.2(IN-)
NetR_2_14_1: R_2_14.1 R_3_14.2 U1_14.2(IN-)
NetR_5_12_1: R_5_12.1 R_6_12.2 U1_12.13(IN-)
NetR_5_13_1: R_5_13.1 R_6_13.2 U1_13.13(IN-)
NetR_5_14_1: R_5_14.1 R_6_14.2 U1_14.13(IN-)

### Notes on the sheet
- (in symbol TL084CN, part A) A
- (in symbol TL084CN, part B) B
- (in symbol TL084CN, part C) C
- (in symbol TL084CN, part D) D

### Library data of the parts
C_1_12-C_1_14 C_2_12-C_2_14 C_3_12-C_3_14 C_4_12-C_4_14 = Capa
R_1_12-R_1_14 R_2_12-R_2_14 R_3_12-R_3_14 R_4_12-R_4_14 R_5_12-R_5_14 R_6_12-R_6_14 = Resistance
U1_12-U1_14 = TL084CN: as U1 on sheet Sheet2; Published: 24-Aug-2001; LatestRevisionDate: 06-Jun-2005; LatestRevisionNote: Stylized 3D Model Added.; DatasheetVersion: Jan-1999; PackageVersion: Jan-1997; PackageReference: DIP14; Publisher: Altium Limited; PackageDescription: DIP; 14 Leads; Row Spacing 7.62 mm; Pitch 2.54 mm; ComponentLink1Description: Manufacturer Link; ComponentLink1URL: http://www.st.com/; ComponentLink2Description: Datasheet; ComponentLink2URL: http://www.st.com/stonline/products/literature/ds/2301/tl084.pdf
D1_12-D1_14 D2_12-D2_14 = Photodiode: Published: 24-Mar-1999; LatestRevisionDate: 17-Jul-2002; LatestRevisionNote: Re-released for DXP Platform.; PackageReference: PIN2; Publisher: Altium Limited

## Sheet Sheet7.SchDoc
size A4
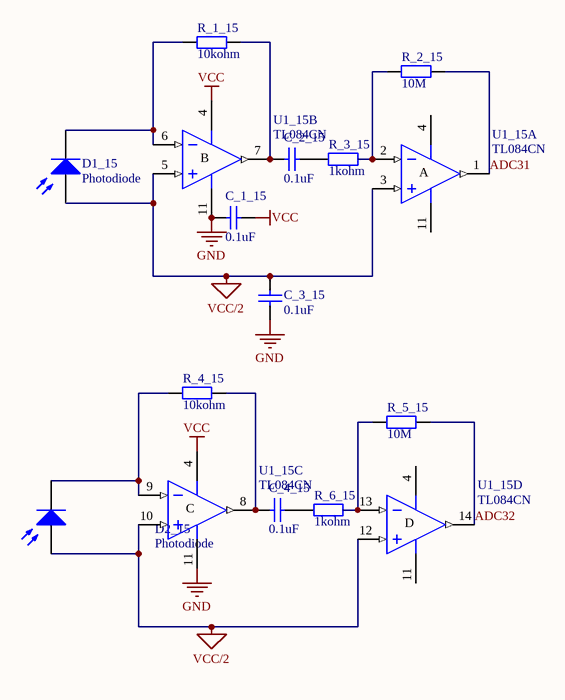
[diagram p6: Sheet7.SchDoc]

### Parts
C_1_15  0.1uF  [cms805 - mini]
C_2_15  0.1uF  [cms805 - mini]
C_3_15  0.1uF  [cms805 - mini]
C_4_15  0.1uF  [cms805 - mini]
D1_15  Photodiode  [TEMD1000]
D2_15  Photodiode  [TEMD1000]
R_1_15  10kohm  [cms805 - mini]
R_2_15  10M  [cms805 - mini]
R_3_15  1kohm  [cms805 - mini]
R_4_15  10kohm  [cms805 - mini]
R_5_15  10M  [cms805 - mini]
R_6_15  1kohm  [cms805 - mini]
U1_15  TL084CN  [TSSOP14]  (parts A,B,C,D of 4)

### Nets
GND: C_1_15.1 C_3_15.1 U1_15.11(V-)
VCC: C_1_15.2 U1_15.4(V+)
VCC/2: C_3_15.2 D1_15.1(A) D2_15.1(A) U1_15.3(IN+) U1_15.5(IN+) U1_15.10(IN+) U1_15.12(IN+)
ADC31: R_2_15.2 U1_15.1(OUT)
ADC32: R_5_15.2 U1_15.14(OUT)
NetC_2_15_1: C_2_15.1 R_3_15.1
NetC_2_15_2: C_2_15.2 R_1_15.2 U1_15.7(OUT)
NetC_4_15_1: C_4_15.1 R_6_15.1
NetC_4_15_2: C_4_15.2 R_4_15.2 U1_15.8(OUT)
NetD1_15_2: D1_15.2(K) R_1_15.1 U1_15.6(IN-)
NetD2_15_2: D2_15.2(K) R_4_15.1 U1_15.9(IN-)
NetR_2_15_1: R_2_15.1 R_3_15.2 U1_15.2(IN-)
NetR_5_15_1: R_5_15.1 R_6_15.2 U1_15.13(IN-)

### Notes on the sheet
- (in symbol TL084CN, part A) A
- (in symbol TL084CN, part B) B
- (in symbol TL084CN, part C) C
- (in symbol TL084CN, part D) D

### Library data of the parts
C_1_15 C_2_15 C_3_15 C_4_15 = Capa
R_1_15 R_2_15 R_3_15 R_4_15 R_5_15 R_6_15 = Resistance
U1_15 = TL084CN: as U1 on sheet Sheet2; Published: 24-Aug-2001; LatestRevisionDate: 06-Jun-2005; LatestRevisionNote: Stylized 3D Model Added.; DatasheetVersion: Jan-1999; PackageVersion: Jan-1997; PackageReference: DIP14; Publisher: Altium Limited; PackageDescription: DIP; 14 Leads; Row Spacing 7.62 mm; Pitch 2.54 mm; ComponentLink1Description: Manufacturer Link; ComponentLink1URL: http://www.st.com/; ComponentLink2Description: Datasheet; ComponentLink2URL: http://www.st.com/stonline/products/literature/ds/2301/tl084.pdf
D1_15 D2_15 = Photodiode: Published: 24-Mar-1999; LatestRevisionDate: 17-Jul-2002; LatestRevisionNote: Re-released for DXP Platform.; PackageReference: PIN2; Publisher: Altium Limited

## Nets that join several sheets
GND: Sheet1 (18 pins), Sheet2 (9 pins), Sheet3 (9 pins), Sheet4 (9 pins), Sheet5 (9 pins), Sheet6 (9 pins), Sheet7 (C_1_15.1 C_3_15.1 U1_15.11)
VCC: Sheet1 (15 pins), Sheet2 (6 pins), Sheet3 (6 pins), Sheet4 (6 pins), Sheet5 (6 pins), Sheet6 (6 pins), Sheet7 (C_1_15.2 U1_15.4)
VCC/2: Sheet1 (R2.1 R3.2), Sheet2 (21 pins), Sheet3 (21 pins), Sheet4 (21 pins), Sheet5 (21 pins), Sheet6 (21 pins), Sheet7 (7 pins)
ADC1: Sheet1 (IC1.27), Sheet2 (R_2.2 U1.1)
ADC2: Sheet1 (IC1.26), Sheet2 (R_5.2 U1.14)
ADC3: Sheet1 (IC1.25), Sheet2 (R_2_1.2 U1_1.1)
ADC4: Sheet1 (IC1.24), Sheet2 (R_5_1.2 U1_1.14)
ADC5: Sheet1 (IC1.23), Sheet2 (R_2_2.2 U1_2.1)
ADC6: Sheet1 (IC1.22), Sheet2 (R_5_2.2 U1_2.14)
ADC7: Sheet1 (IC1.21), Sheet3 (R_2_3.2 U1_3.1)
ADC8: Sheet1 (IC1.20), Sheet3 (R_5_3.2 U1_3.14)
ADC9: Sheet1 (IC1.19), Sheet3 (R_2_4.2 U1_4.1)
ADC10: Sheet1 (IC1.18), Sheet3 (R_5_4.2 U1_4.14)
ADC11: Sheet1 (IC1.9), Sheet3 (R_2_5.2 U1_5.1)
ADC12: Sheet1 (IC1.8), Sheet3 (R_5_5.2 U1_5.14)
ADC13: Sheet1 (IC1.7), Sheet4 (R_2_6.2 U1_6.1)
ADC14: Sheet1 (IC1.6), Sheet4 (R_5_6.2 U1_6.14)
ADC15: Sheet1 (IC1.5), Sheet4 (R_2_7.2 U1_7.1)
ADC16: Sheet1 (IC1.4), Sheet4 (R_5_7.2 U1_7.14)
ADC17: Sheet1 (IC1.3), Sheet4 (R_2_8.2 U1_8.1)
ADC18: Sheet1 (IC1.100), Sheet4 (R_5_8.2 U1_8.14)
ADC19: Sheet1 (IC1.99), Sheet5 (R_2_9.2 U1_9.1)
ADC20: Sheet1 (IC1.98), Sheet5 (R_5_9.2 U1_9.14)
ADC21: Sheet1 (IC1.94), Sheet5 (R_2_10.2 U1_10.1)
ADC22: Sheet1 (IC1.93), Sheet5 (R_5_10.2 U1_10.14)
ADC23: Sheet1 (IC1.92), Sheet5 (R_2_11.2 U1_11.1)
ADC24: Sheet1 (IC1.91), Sheet5 (R_5_11.2 U1_11.14)
ADC25: Sheet1 (IC1.44), Sheet6 (R_2_12.2 U1_12.1)
ADC26: Sheet1 (IC1.43), Sheet6 (R_5_12.2 U1_12.14)
ADC27: Sheet1 (IC1.42), Sheet6 (R_2_13.2 U1_13.1)
ADC28: Sheet1 (IC1.41), Sheet6 (R_5_13.2 U1_13.14)
ADC29: Sheet1 (IC1.35), Sheet6 (R_2_14.2 U1_14.1)
ADC30: Sheet1 (IC1.34), Sheet6 (R_5_14.2 U1_14.14)
ADC31: Sheet1 (IC1.33), Sheet7 (R_2_15.2 U1_15.1)
ADC32: Sheet1 (IC1.32), Sheet7 (R_5_15.2 U1_15.14)